# EAGLE design ServoMicro_plusPower (EAGLE 9.6.0)
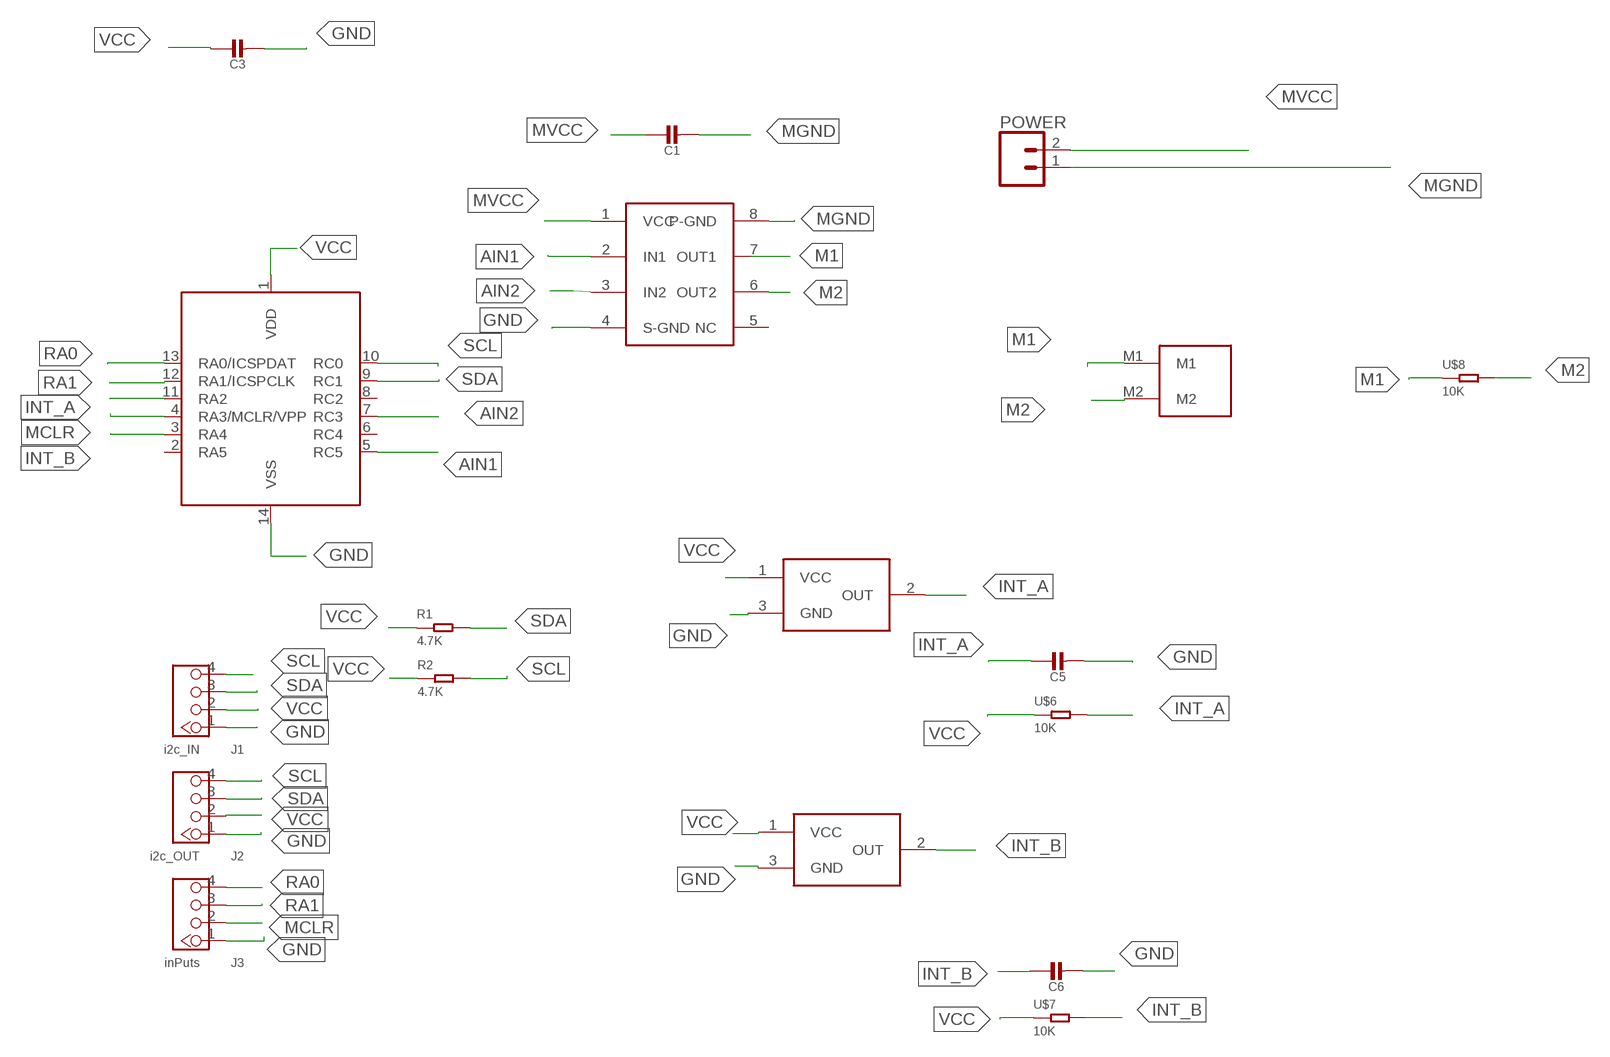
[diagram p0: schematic, sheet 1]

## Parts
C1  CAP_CERAMIC0805-NOOUTLINE  [0805-NO]
C3  CAP_CERAMIC0805-NOOUTLINE  [0805-NO]
C5  CAP_CERAMIC0805-NOOUTLINE  [0805-NO]
C6  CAP_CERAMIC0805-NOOUTLINE  [0805-NO]
J1  i2c_IN  GROVE-CONNECTOR-DIP(4P-2.0)  [HW4-2.0]
J2  i2c_OUT  GROVE-CONNECTOR-DIP(4P-2.0)  [HW4-2.0]
J3  inPuts  GROVE-CONNECTOR-DIP(4P-2.0)  [HW4-2.0]
POWER  CONN_02-JST-2-PTH-NO_SILK  [JST-2-PTH-NS]
R1  4.7K  SMD-RES-4.7K-5%-1/8W(0805)  [R0805]
R2  4.7K  SMD-RES-4.7K-5%-1/8W(0805)  [R0805]
U$1  LB1938DFA_A  [MSOP8]
U$2  DRV5021-Q1  [SOT-23]
U$3  DRV5021-Q1  [SOT-23]
U$4  MICRO_MOTOR  [MICRO_MOTOR]
U$5  PIC16F1503SOIC  [SO-14]
U$6  10K  SMD-RES-10K-1%-1/8W(0805)  [R0805]
U$7  10K  SMD-RES-10K-1%-1/8W(0805)  [R0805]
U$8  10K  SMD-RES-10K-1%-1/8W(0805)  [R0805]

## Nets
AIN1: U$1.2(IN1) U$5.5(RC5)
AIN2: U$1.3(IN2) U$5.7(RC3)
GND: C3.2 C5.2 C6.2 J1.1 J2.1 J3.1 U$1.4(S-GND) U$2.3(GND) U$3.3(GND) U$5.14(VSS)
INT_A: C5.1 U$2.2(OUT) U$5.11(RA2) U$6.2
INT_B: C6.1 U$3.2(OUT) U$5.3(RA4) U$7.2
M1: U$1.7(OUT1) U$4.M1 U$8.1
M2: U$1.6(OUT2) U$4.M2 U$8.2
MCLR: J3.2 U$5.4(RA3/MCLR/VPP)
MGND: C1.2 POWER.1 U$1.8(P-GND)
MVCC: C1.1 POWER.2 U$1.1(VCC)
RA0: J3.4 U$5.13(RA0/ICSPDAT)
RA1: J3.3 U$5.12(RA1/ICSPCLK)
SCL: J1.4 J2.4 R2.2 U$5.10(RC0)
SDA: J1.3 J2.3 R1.2 U$5.9(RC1)
VCC: C3.1 J1.2 J2.2 R1.1 R2.1 U$2.1(VCC) U$3.1(VCC) U$5.1(VDD) U$6.1 U$7.1
Unconnected: U$1.5(NC) U$5.2(RA5) U$5.6(RC4) U$5.8(RC2)

## Library data of the parts
C1 C3 C5 C6 = audio amplifier example:CAP_CERAMIC
J1-J3 = Seeed-Connector:GROVE-CONNECTOR-DIP(4P-2.0): 320110033; VALUE: 4P-2.0
POWER = alex:CONN_02: Multi connection point. Often used as Generic Header-pin footprint for 0.1 inch spaced/style header connections On any of the 0.1 inch spaced packages, you can populate with these: Break Away Headers - Straight <https://www.sparkfun.com/products/116> (PRT-00116) Break Away Male Headers - Right Angle <https://www.sparkfun.com/products/553> (PRT-00553) Female Headers <https://www.sparkfun.com/products/115> (PRT-00115) Break Away Headers - Machine Pin <https://www.sparkfun.com/products/117> (PRT-00117) Break Away Female Headers - Swiss Machine Pin <https://www.sparkfun.com/products/743> (PRT-00743) For SCREWTERMINALS and SPRING TERMINALS visit here: Screw Terimnals on SparkFun.com <https://www.sparkfun.com/search/results?term=Screw+Terminals> (5mm/3.5mm/2.54mm spacing) This device is also useful as a general connection point to wire up your design to another part of your project. Our various solder wires solder well into these plated through hole pads. Hook-Up Wire - Assortment (Stranded, 22 AWG) <https://www.sparkfun.com/products/11375> (PRT-11375) Hook-Up Wire - Assortment (Solid Core, 22 AWG) <https://www.sparkfun.com/products/11367> (PRT-11367) View the entire wire category on our website here <https://www.sparkfun.com/categories/141> Special notes: Molex polarized connector foot print use with: PRT-08233 with associated crimp pins and housings. 2.54_SCREWTERM for use with PRT-10571. 3.5mm Screw Terminal footprints for PRT-08084 5mm Screw Terminal footprints for use with PRT-08432
R1 R2 = Seeed-Resistor:SMD-RES-4.7K-5%-1/8W(0805): 301010306; MPN: RC0805JR-074K7L
U$1 = LB1938FA:LB1938DFA_A
U$2 U$3 = LB1938FA:DRV5021-Q1
U$4 = LB1938FA:MICRO_MOTOR
U$5 = PIC16F1503:PIC16F1503
U$6-U$8 = Seeed-Resistor:SMD-RES-10K-1%-1/8W(0805): 301010361; MPN: RC0805FR-0710KL

## Board
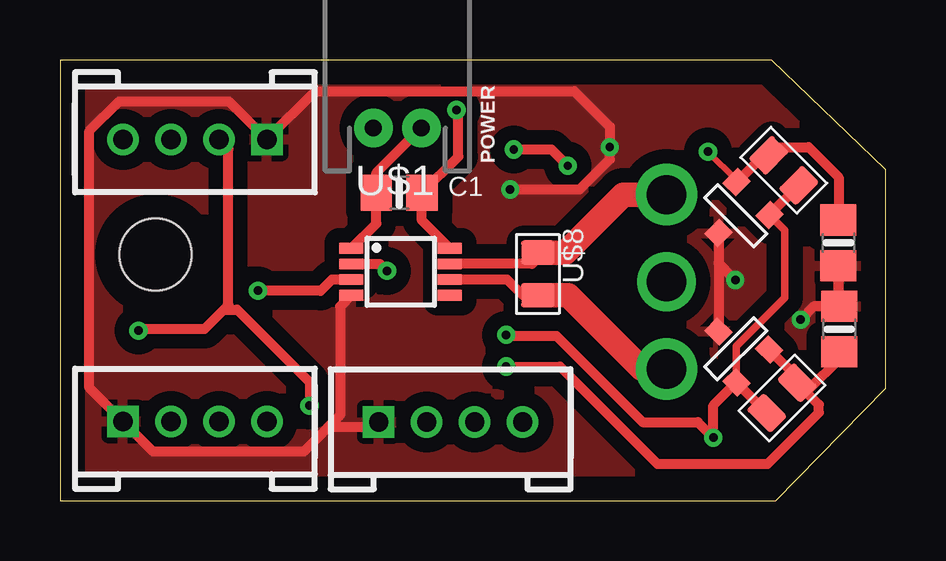
[diagram p1: board, top side]
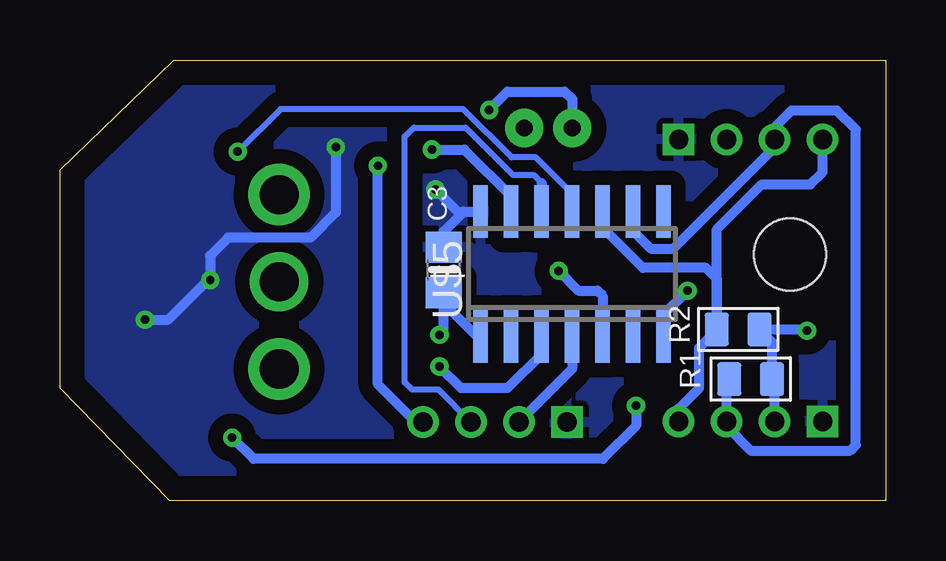
[diagram p2: board, bottom side, seen from below]

Size 34.4 x 18.37 mm. Coordinates in mm from the lower left corner, seen from the top.
Outline: 0,0 29.83,0 34.4,4.7 34.4,13.79 29.65,18.37 0,18.37 0,0
Copper layers (1*16): Top 0.035mm / dielectric 1.5mm / Bottom 0.035mm
Design rules "default": minimum track width 6mil, minimum drill 0.35mm, track to track 6mil, track to pad 6mil, pad to pad 6mil, via to via 6mil, smd to smd 6mil, copper to edge 40mil, drill to drill 6mil, minimum pad ring 10mil, minimum via ring 8mil, stop-mask expansion 4mil, vias tented up to drill 0mil, thermal gap 10mil
Holes 3 mm at 3.98,10.27

### Footprints (pad centres in the part's own frame; a part is rotated, then mirrored left to right if it is on the bottom)
0805-NO = smd 1.3 x 1.5: 1 -0.95,0; 2 0.95,0
HW4-2.0 = drill 0.8 pad 1.27 square: 1 -3,0 | drill 0.8 pad 1.27: 2 -1,0; 3 1,0; 4 3,0
JST-2-PTH-NS = drill 0.7 pad 1.6: 1 -1,0; 2 1,0
R0805 = smd 1.397 x 1.016: 1 0,0.889; 2 0,-0.889
MSOP8 = smd 0.45 x 1: 1 -0.975,-2.05; 2 -0.325,-2.05; 3 0.325,-2.05; 4 0.975,-2.05; 5 0.975,2.05; 6 0.325,2.05; 7 -0.325,2.05; 8 -0.975,2.05
SOT-23 = smd 0.787 x 0.889: 1 0.991,1.016; 2 -0.94,1.016; 3 0.025,-1.016
MICRO_MOTOR = drill 1.63 pad 2.56: M1 0,3.63; M2 0,-3.63 | drill 1.63 pad 2.27: NC 0,0
SO-14 = smd 0.6 x 2.2: 1 -3.81,-2.6; 2 -2.54,-2.6; 3 -1.27,-2.6; 4 0,-2.6; 5 1.27,-2.6; 6 2.54,-2.6; 7 3.81,-2.6; 8 3.81,2.6; 9 2.54,2.6; 10 1.27,2.6; 11 0,2.6; 12 -1.27,2.6; 13 -2.54,2.6; 14 -3.81,2.6

### Placement (x,y rotation side)
C1  14.13,12.84 0 top
C3  18.41,9.63 90 bottom
C5  32.43,10.76 270 top
C6  32.47,7.16 90 top
J1  5.62,3.31 0 top
J2  5.62,15.06 180 top
J3  16.28,3.29 0 top
POWER  14.06,15.54 0 top
R1  5.62,5.08 270 bottom
R2  6.14,7.15 270 bottom
U$1  14.2,9.55 270 top
U$2  28.14,11.9 315 top
U$3  28.17,6.36 225 top
U$4  25.27,9.13 0 top
U$5  13.07,9.46 0 bottom
U$6  30.16,13.78 225 top
U$7  30.08,4.29 135 top
U$8  19.91,9.46 0 top

### Tracks (layer width: path | path; a pad name or v marks a point on that pad's centre or on a via)
AIN1  (via drill 0.35)
  Top 0.406: v13.62,9.59 v13.61,9.59 13.32,9.88 U$1.2
  Bottom 0.406: v13.62,9.59 12.8,8.76 12.01,8.76 11.79,8.55 U$5.5
AIN2  (via drill 0.35)
  Top 0.406: U$1.3 11.33,9.23 10.85,8.75 8.26,8.75 v8.25,8.76
  Bottom 0.406: v8.25,8.76 9.25,7.76 U$5.7
GND  (via drill 0.35)
  Top 0.406: C5.2 32.43,8.15 C6.2 31.41,8.11 v30.86,7.56 | U$2.3 27.44,9.91 | 27.44,9.91 27.44,7.08 U$3.3 | J3.1 13.06,3.07 11.17,3.07 | 11.17,3.07 11.16,3.07 11.67,3.58 11.67,8.1 U$1.4 | 11.17,3.07 10.17,2.07 3.87,2.07 J1.1 1.23,4.71 1.23,15.42 2.46,16.65 7.04,16.65 J2.1 10.64,17.08 21.42,17.08 22.91,15.6 v22.91,14.75 22.91,14.24 21.65,12.98 v18.75,12.98 | v28.14,9.21 27.44,9.91
  Bottom 0.406: v30.86,7.56 29.89,7.56 28.24,9.21 v28.14,9.21 28.14,10.22 27.39,10.97 23.96,10.97 22.91,12.03 v22.91,14.75 | C3.2 18.41,11.23 17.58,12.06 U$5.14 17.84,12.06 v18.75,12.98 18.82,13.04
  pour Bottom (isolate 0.61): 0.2,18.34 29.46,18.34 34.3,13.5 34.3,4.7 29.74,0.14 0.38,0.14 0.15,0.37 0.09,0.43 0.09,18.45
  pour Top (isolate 0.61): 0.2,18.19 29.51,18.19 34.11,13.59 34.11,4.83 29.6,0.32 1.74,0.32 0.2,1.85
INT_A  (via drill 0.35)
  Top 0.254: v27,14.55 28.2,13.36 U$2.2
  Top 0.406: U$2.2 29.32,14.41 U$6.2 29.87,14.75 31.19,14.75 32.45,13.49 32.45,11.72 C5.1
  Bottom 0.254: U$5.11 13.06,12.8 14.58,14.31 15.58,14.31 17.6,16.33 25.21,16.33 26.98,14.55 v27,14.55
INT_B  (via drill 0.35)
  Top 0.406: U$3.2 30.71,5.15 | 30.71,5.15 31.21,4.65 32.47,5.91 C6.1 | 30.71,5.15 U$7.2 31.62,4.01 31.62,3.68 29.49,1.55 24.89,1.55 20.84,5.6 v18.59,5.6
  Bottom 0.406: U$5.3 14.33,6.12 15.76,4.7 17.69,4.7 v18.59,5.6
M1
  Top 0.406: U$8.1 19.91,10.11 19.68,9.88 U$1.7
  Top 1.016: U$8.1 21.05,10.35 23.46,12.76 U$4.M1
M2
  Top 0.406: U$8.2 19.29,8.57 18.63,9.23 U$1.6
  Top 1.016: U$8.2 21.17,8.57 24.24,5.5 U$4.M2
MCLR
  Bottom 0.406: J3.2 13.06,5.5 U$5.4
MGND  (via drill 0.35)
  Top 0.406: U$1.8 15.08,11.69 C1.2 16.6,14.35 16.6,16.24 16.54,16.29 v16.52,16.29
  Bottom 0.406: v16.52,16.29 15.76,17.06 13.38,17.06 13.06,16.73 POWER.1
MVCC
  Top 0.406: U$1.1 13.18,11.56 C1.1 13.18,13.67 POWER.2
RA0  (via drill 0.35)
  Top 0.406: v21.15,13.97 20.48,14.64 v18.91,14.64
  Bottom 0.406: J3.4 19.58,3.29 21.15,4.86 v21.15,13.97 | v18.91,14.64 17.55,14.64 15.6,12.7 U$5.13
RA1
  Bottom 0.254: J3.3 18.62,4.64 19.73,4.64 20.04,4.94 20.04,15.18 19.66,15.56 17.5,15.56 15.53,13.59 14.66,13.59 14.33,13.26
  Bottom 0.406: 14.33,13.26 U$5.12
SCL
  Bottom 0.406: J1.4 8.62,3.85 7.77,4.7 7.77,6.38 7.03,7.11 R2.2 | U$5.10 11.76,12.02 11.76,11.35 10.12,9.72 7.49,9.72 7.03,9.26 R2.2 | R2.2 7.03,11.32 5.15,13.2 3.13,13.2 2.62,13.71 J2.4
SDA
  Bottom 0.406: R1.2 6.62,4.97 J1.3 6.62,3.11 5.61,2.1 1.48,2.1 1.24,2.34 1.24,15.48 2.03,16.27 3.92,16.27 4.62,15.57 J2.3 4.62,14.74 8.85,10.52 9.79,10.52 10.52,11.25 U$5.9
VCC  (via drill 0.35)
  Top 0.305: U$3.1 28.18,6.44 30.2,8.46 30.2,11.28 U$2.1
  Top 0.406: U$7.1 U$3.1 27.23,3.99 v27.23,2.64 26.58,3.29 24.28,3.29 20.68,6.88 18.59,6.88 v18.59,6.92 | U$2.1 U$6.1 | v3.27,7.1 3.35,7.18 6.03,7.18 6.82,7.97 | 6.82,7.97 7.02,8.17 7.02,14.67 J2.2 | 6.82,7.97 7.38,7.97 10.4,4.95 v10.4,3.98
  Bottom 0.406: J1.2 4.62,4.97 R1.1 4.73,6.63 R2.1 3.32,7.15 v3.27,7.1 | v10.4,3.98 10.4,3.14 11.78,1.75 26.34,1.75 v27.23,2.64 | v18.59,6.92 18.41,7.1 C3.1 18.41,8.24 17.03,6.86 U$5.1